# EAGLE schematic micro_logic (EAGLE 6.5.0)
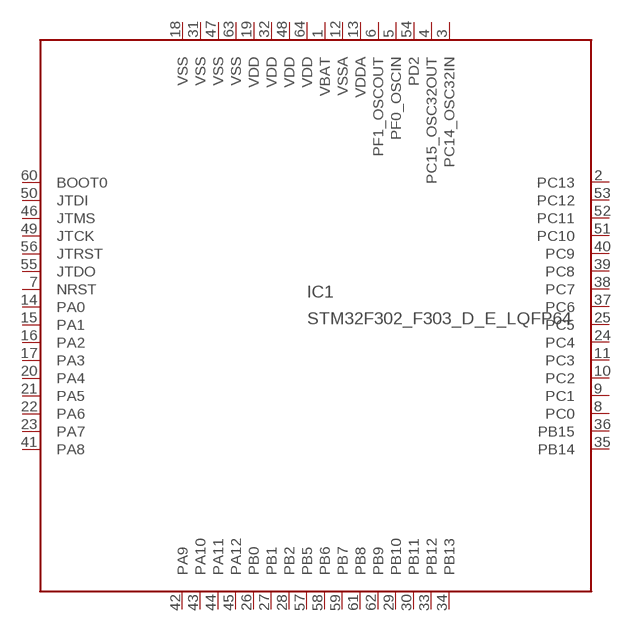
[diagram p0: schematic, sheet 1]

## Parts
IC1  STM32F302_F303_D_E_LQFP64  [LQFP64]
Unconnected: IC1.1(VBAT) IC1.2(PC13) IC1.3(PC14_OSC32IN) IC1.4(PC15_OSC32OUT) IC1.5(PF0_OSCIN) IC1.6(PF1_OSCOUT) IC1.7(NRST) IC1.8(PC0) IC1.9(PC1) IC1.10(PC2) IC1.11(PC3) IC1.14(PA0) IC1.15(PA1) IC1.16(PA2) IC1.17(PA3) IC1.20(PA4) IC1.21(PA5) IC1.22(PA6) IC1.23(PA7) IC1.24(PC4) IC1.25(PC5) IC1.26(PB0) IC1.27(PB1) IC1.28(PB2) IC1.29(PB10) IC1.30(PB11) IC1.33(PB12) IC1.34(PB13) IC1.35(PB14) IC1.36(PB15) IC1.37(PC6) IC1.38(PC7) IC1.39(PC8) IC1.40(PC9) IC1.41(PA8) IC1.42(PA9) IC1.43(PA10) IC1.44(PA11) IC1.45(PA12) IC1.46(JTMS) IC1.49(JTCK) IC1.50(JTDI) IC1.51(PC10) IC1.52(PC11) IC1.53(PC12) IC1.54(PD2) IC1.55(JTDO) IC1.56(JTRST) IC1.57(PB5) IC1.58(PB6) IC1.59(PB7) IC1.60(BOOT0) IC1.61(PB8) IC1.62(PB9)

## Power pins joined to a net without a drawn wire
VDD: IC1.19(VDD) IC1.32(VDD) IC1.48(VDD) IC1.64(VDD)
VDDA: IC1.13(VDDA)
VSS: IC1.18(VSS) IC1.31(VSS) IC1.47(VSS) IC1.63(VSS)
VSSA: IC1.12(VSSA)

## Library data of the parts
IC1 = brushlessrage:STM32F302_F303_D_E_LQFP64: STM32F302_F303_D_E_LQFP64 edit this description Auto generated by make-symbol-device-package-bsdl.ulp Rev. 43 Source: STM32F302_F303_D_E_LQFP64.bsd